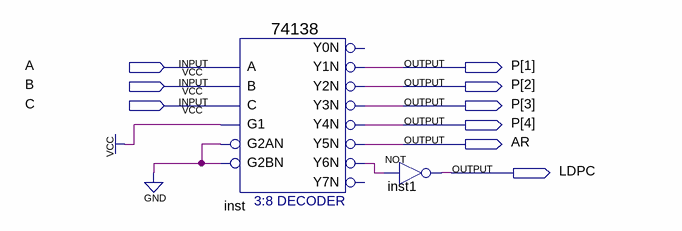
[diagram p0: schematic sheet]
// Quartus schematic decoder_C.bdf as structural Verilog: 2 symbols, 9 pins
module decoder_C (
  input  A,
  input  B,
  input  C,
  output [4:1] P,
  output AR,
  output LDPC
);

  wire inst_y6n;

  \74138  inst (
    .A(A), .B(B), .G1(1'b1), .C(C), .G2AN(1'b0), .G2BN(1'b0), .Y1N(P[1]), .Y2N(P[2]), .Y3N(P[3]), .Y4N(P[4]),
    .Y5N(AR), .Y6N(inst_y6n));  // open: Y0N, Y7N
  not inst1 (LDPC, inst_y6n);
endmodule
